# Altium project PCB_Project1.PrjPCB
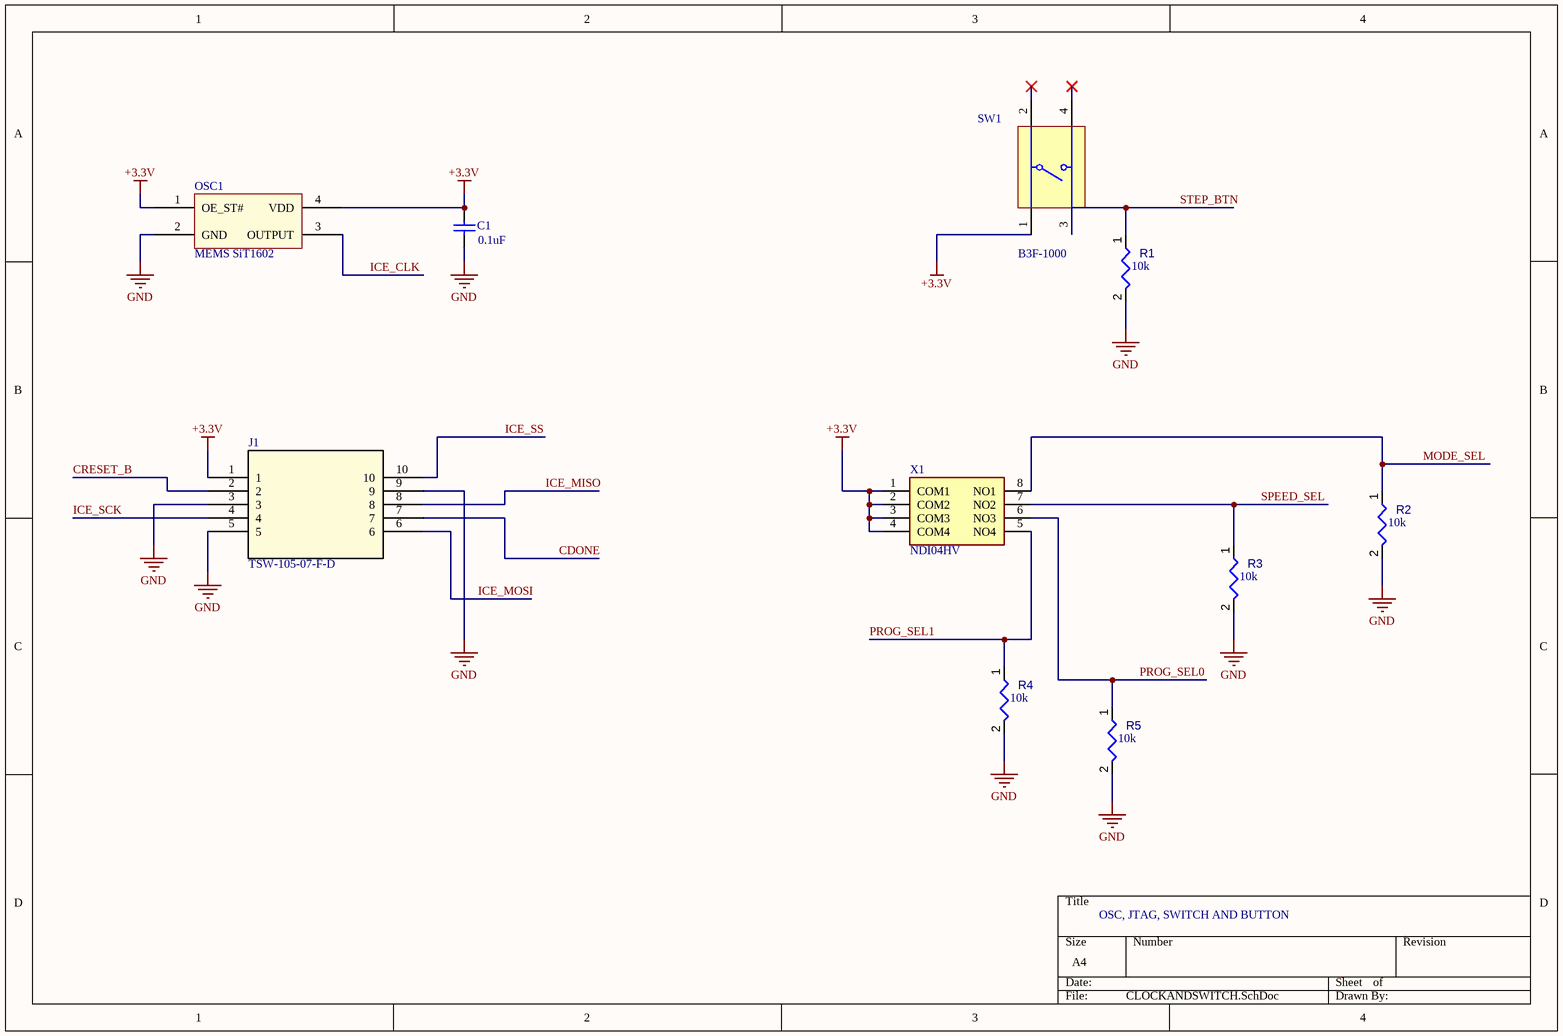
[diagram p0: CLOCKANDSWITCH.SchDoc]
4 sheets, 52 parts. Net scope: global (net labels, ports and power ports of the same name join across sheets).
Board file: PCB1.PcbDoc
Sheets:
  CLOCKANDSWITCH.SchDoc
  Misc.SchDoc
  FPGA.SchDoc
  7seg.SchDoc

## Sheet CLOCKANDSWITCH.SchDoc
size A4; PageSetup: Record=PageOptions|CenterHorizontal=True|CenterVertical=True|PrintScale=1.00|XCorrection=1.00|YCorrection=1.00|PrintKind=2|BorderSize=5000000|LeftOffset=0|BottomOffset=0|Orientation=2|PaperLength=1000|PaperWidth=1000|Scale=100|PaperSource=7|PrintQuality=-3|MediaType=1|DitherType=10|PrintScaleMode=1|PaperKind=A4|PaperIndex=9

### Parts
C1  value 0.1uF  [C0402]  (hidden comment: Cap Semi)
J1  TSW-105-07-F-D  [TSW-105-07-G-D_SAI]
OSC1  MEMS SiT1602  [oscMEMS1602]
R1  value 10k  [RESC2013X50X35ML15T15]  (hidden comment: Resistor 10k +/-1% 0805 125 mW)
R2  value 10k  [RESC2013X50X35ML15T15]  (hidden comment: Resistor 10k +/-1% 0805 125 mW)
R3  value 10k  [RESC2013X50X35ML15T15]  (hidden comment: Resistor 10k +/-1% 0805 125 mW)
R4  value 10k  [RESC2013X50X35ML15T15]  (hidden comment: Resistor 10k +/-1% 0805 125 mW)
R5  value 10k  [RESC2013X50X35ML15T15]  (hidden comment: Resistor 10k +/-1% 0805 125 mW)
SW1  B3F-1000  [OMRON-B3F-1000-4_V]
X1  NDI04HV  [NDI04HV]

### Nets
+3.3V: C1.2 J1.1 OSC1.1(OE_ST#) OSC1.4(VDD) SW1.1 X1.1(COM1) X1.2(COM2) X1.3(COM3) X1.4(COM4)
GND: C1.1 J1.3 J1.5 J1.9 OSC1.2(GND) R1.2 R2.2 R3.2 R4.2 R5.2
CDONE: J1.7
CRESET_B: J1.2
ICE_CLK: OSC1.3(OUTPUT)
ICE_MISO: J1.8
ICE_MOSI: J1.6
ICE_SCK: J1.4
ICE_SS: J1.10
MODE_SEL: R2.1 X1.8(NO1)
PROG_SEL0: R5.1 X1.6(NO3)
PROG_SEL1: R4.1 X1.5(NO4)
SPEED_SEL: R3.1 X1.7(NO2)
STEP_BTN: R1.1 SW1.3

Not connected (* = marked no-connect by the designer): SW1 2* 4*

### Notes on the sheet
- OSC, JTAG, SWITCH AND BUTTON

### Library data of the parts
C1 = Cap Semi: Capacitor (Semiconductor SIM Model); Manufacturer: Samsung Electro-Mechanics; Manufacturer Part Number: CL05B104KA5NNNC; Tolerance: ±10%; Voltage - Rated: 25V; Temperature Coefficient: X7R; Notification: Current market demand for these product types have resulted in fluctuating and extending lead times. Lead times may differ.; Published: 8-Jun-2000; LatestRevisionDate: 29-May-2009; LatestRevisionNote: IPC-7351 Footprint Added.; PackageReference: C1206; Publisher: Altium Limited; PackageDescription: Chip Capacitor; Supplier 1: Digi-Key; Supplier Part Number 1: 1276-6720-1-ND; RoHS: RoHS Compliant; Category: Capacitors; Stock 1: 0; Pricing 1: 1=0.1, 10=0.071, 100=0.0317, 500=0.02262, 1000=0.01777, 2500=0.01616, 5000=0.01486 (USD); Packaging: Cut Tape (CT); Part Status: Active; Operating Temperature: -55°C ~ 125°C; Features: -; Ratings: -; Applications: General Purpose; Mounting Type: Surface Mount, MLCC; Package / Case: 0402 (1005 Metric); Size / Dimension: 0.039" L x 0.020" W (1.00mm x 0.50mm); Height - Seated (Max): -; Thickness (Max): 0.022" (0.55mm); Lead Spacing: -; Lead Style: -; ComponentLink1URL: http://www.samsungsem.com/kr/support/product-search/mlcc/CL05B104KA5NNNC.jsp; ComponentLink1Description: http://www.samsungsem.com/kr/support/product-search/mlcc/CL05B104KA5NNNC.jsp
J1 = CMP-007-000000-1: Description; Manufacturer_Name: Samtec Inc; Source: TSW-105-07-F-D.SchLib; Design Item ID: TSW-105-07-F-D; Manufacturer_Part_Number: TSW-105-07-F-D; Copyright: Copyright (C) 2025 Ultra Librarian. All rights reserved.; Type: Type; RefDes: RefDes
OSC1 = SIT1602AC-13-33E-12.000000G: MEMS OSC XO 12.0000MHZ LVCMOS; Manufacturer: SiTIME; Function: Enable/Disable; Voltage - Supply: 3.3V; Frequency Stability: ±50ppm; Current - Supply (Max): 4.5mA; Current - Supply (Disable) (Max): 4mA; Supplier 1: Digi-Key; Manufacturer Part Number: SIT1602AC-13-33E-12.000000G; RoHS: RoHS Compliant; Category: Crystals, Oscillators, Resonators; Packaging: Cut Tape (CT); Part Status: Not For New Designs; Base Resonator: MEMS; Type: XO (Standard); Output: LVCMOS; Operating Temperature: -20°C ~ 70°C; Ratings: -; Mounting Type: Surface Mount; Package / Case: 4-SMD, No Lead; Size / Dimension: 0.098" L x 0.079" W (2.50mm x 2.00mm); Height - Seated (Max): 0.032" (0.80mm); ComponentLink1URL: https://media.digikey.com/pdf/Data%20Sheets/SiTime%20PDFs/SIT1602A.pdf; ComponentLink1Description: https://media.digikey.com/pdf/Data%20Sheets/SiTime%20PDFs/SIT1602A.pdf; Supplier Part Number 1: 1473-1051-1-ND; Pricing 1: 1=1.26, 10=1.118, 50=1.045, 100=0.9236 (USD)
R1-R5 = CMP-009-00018-5: Chip Resistor, 10 KOhm, +/- 1%, 125 mW, -55 to 155 degC, 0805 (2012 Metric); Power: 125mW; Voltage Rating: 150V; Tolerance: 1%; Pins: 2; Min Operating Temperature: -55°C; Case/Package: 0805; Max Operating Temperature: 155°C; RoHS Compliant: True; Mounting Technology: SM
SW1 = CMP-011-00004-2: Tactile Switch, SPST-NO, 0.05 A, 24 V, -25 to 70 degC, 4-Pin THD, RoHS, Bulk; Manufacturer: Omron Electronic Components; Throw Configuration: SPST; Max Contact Resistance: 100mohm; Resistance: 0.1Ohm; Max Current Rating: 50mA; Voltage Rating: 24V; Operating Force: 100gf; Datasheet Version: Jan-15; Case/Package: B3F-1000; Packaging: Bulk; Package Description: 4-Pin Through Hole Device, Body 6 x 6 mm; Manufacturer URL: http://www.omron.com/; Package Reference: B3F-1000; Contact Plating: Gold; Contact Current Rating: 50mA; RoHS Compliant: True; Contact Material: Gold; Mounting Technology: TH; Max Operating Temperature: 70°C; Min Operating Temperature: -25°C; Package Quantity: 1500; Datasheet URL: http://www.omron.com/ecb/products/pdf/en-b3f.pdf; Voltage Rating (DC): 24V; Pins: 4; Current Rating: 50mA; Max Voltage Rating (DC): 24V
X1 = CMP-014-000000-1: Dip Switch SPST 4 Position Through Hole Slide (Standard) Actuator 25mA 24VDC; Manufacturer_Name: Apem; Geometry.Height: 5mm; Mouser Part Number: 642-NDI04HV; Source: NDI04HV.SchLib; Mouser Price/Stock: https://www.mouser.co.uk/ProductDetail/Apem/NDI04HV/?qs=4pzlT8jjbheYf%2FxKjHex%252BQ%3D%3D; Datasheet Link: https://www.mouser.ca/datasheet/2/26/NDI_DM_DIPS-276092.pdf; Design Item ID: NDI04HV; Manufacturer_Part_Number: NDI04HV

## Sheet Misc.SchDoc
size A4
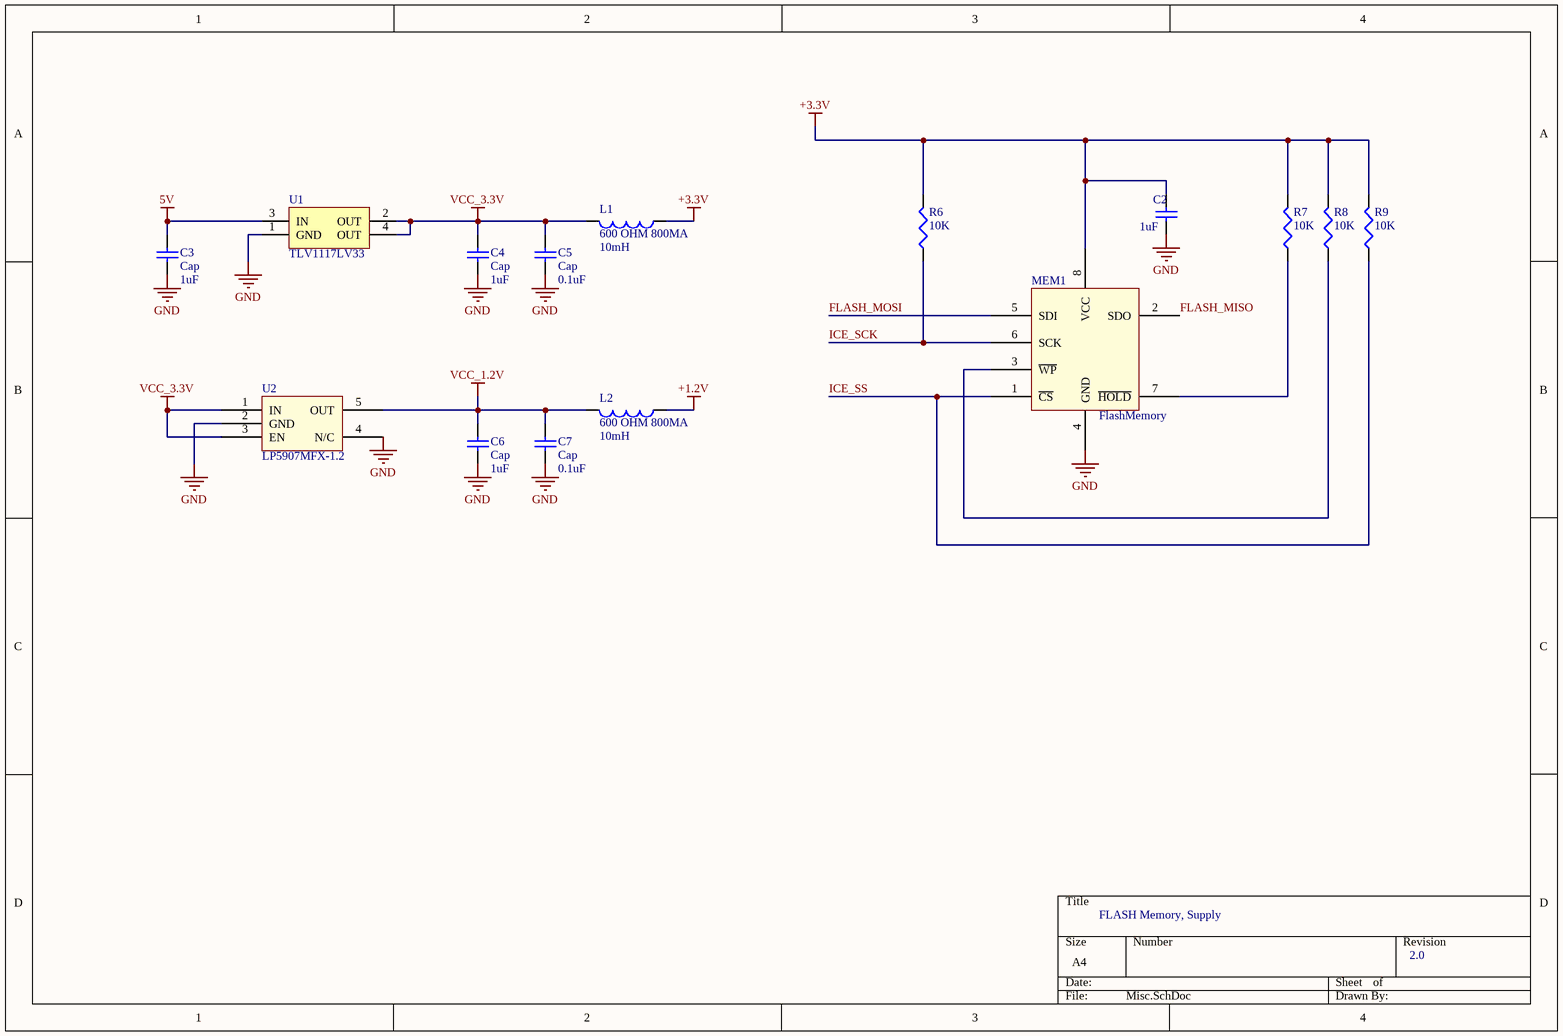
[diagram p1: Misc.SchDoc]

### Parts
C2  value 1uF  [C0402]  (hidden comment: Cap Semi)
C3  Cap  value 1uF  [C0603]
C4  Cap  value 1uF  [C0603]
C5  Cap  value 0.1uF  [C0402]
C6  Cap  value 1uF  [C0402]
C7  Cap  value 0.1uF  [C0402]
L1  600 OHM 800MA  value 10mH  [J1-0603]
L2  600 OHM 800MA  value 10mH  [J1-0603]
MEM1  FlashMemory  [SOP8FlashCorrect]
R6  value 10K  [R0402]  (hidden comment: Res3)
R7  value 10K  [R0402]  (hidden comment: Res3)
R8  value 10K  [R0402]  (hidden comment: Res3)
R9  value 10K  [R0402]  (hidden comment: Res3)
U1  TLV1117LV33  [ZZ311]
U2  LP5907MFX-1.2  [1-2Regulator]

### Nets
5V: C3.2 U1.3(IN)
+1.2V: L2.1
+3.3V: C2.2 L1.1 MEM1.8(VCC) R6.2 R7.2 R8.2 R9.2
GND: C2.1 C3.1 C4.1 C5.1 C6.1 C7.1 MEM1.4(GND) U1.1(GND) U2.2(GND) U2.4(N/C)
VCC_1.2V: C6.2 C7.2 L2.2 U2.5(OUT)
VCC_3.3V: C4.2 C5.2 L1.2 U1.2(OUT) U1.4(OUT) U2.1(IN) U2.3(EN)
FLASH_MISO: MEM1.2(SDO)
FLASH_MOSI: MEM1.5(SDI)
ICE_SCK: MEM1.6(SCK) R6.1
ICE_SS: MEM1.1(~{CS}) R9.1
NetMEM1_3: MEM1.3(~{WP}) R8.1
NetMEM1_7: MEM1.7(~{HOLD}) R7.1

### Notes on the sheet
- FLASH Memory, Supply
- 2.0

### Library data of the parts
C2 C6 = Cap Semi: Capacitor (Semiconductor SIM Model); Manufacturer: TDK Corporation; Manufacturer Part Number: CGB2A1JB1E105M033BC; Tolerance: ±20%; Voltage - Rated: 25V; Temperature Coefficient: JB; Notification: Current market demand for these product types have resulted in fluctuating and extending lead times. Lead times may differ.; Published: 8-Jun-2000; LatestRevisionDate: 29-May-2009; LatestRevisionNote: IPC-7351 Footprint Added.; PackageReference: C1206; Publisher: Altium Limited; PackageDescription: Chip Capacitor; Supplier 1: Digi-Key; Supplier Part Number 1: 445-12016-1-ND; RoHS: RoHS Compliant; Category: Capacitors; Stock 1: 0; Pricing 1: 1=0.25, 10=0.173, 100=0.0874, 500=0.0598, 1000=0.0529, 2500=0.0506, 5000=0.046 (USD); Packaging: Cut Tape (CT); Part Status: Active; Operating Temperature: -25°C ~ 85°C; Features: Low Profile; Ratings: -; Applications: General Purpose; Failure Rate: -; Mounting Type: Surface Mount, MLCC; Package / Case: 0402 (1005 Metric); Size / Dimension: 0.039" L x 0.020" W (1.00mm x 0.50mm); Height - Seated (Max): -; Thickness (Max): 0.013" (0.33mm); Lead Spacing: -; Lead Style: -; ComponentLink1URL: https://product.tdk.com/info/en/catalog/datasheets/mlcc_commercial_lowprofile_en.pdf; ComponentLink1Description: https://product.tdk.com/info/en/catalog/datasheets/mlcc_commercial_lowprofile_en.pdf
C3 C4 = Cap Semi: Capacitor (Semiconductor SIM Model); Manufacturer: Yageo; Manufacturer Part Number: CC0603KRX5R8BB105; Tolerance: ±10%; Voltage - Rated: 25V; Temperature Coefficient: X5R; Notification: Current market demand for these product types have resulted in fluctuating and extending lead times. Lead times may differ.; Published: 8-Jun-2000; LatestRevisionDate: 29-May-2009; LatestRevisionNote: IPC-7351 Footprint Added.; PackageReference: C1206; Publisher: Altium Limited; PackageDescription: Chip Capacitor; Supplier 1: Digi-Key; Supplier Part Number 1: 311-1445-1-ND; RoHS: RoHS Compliant; Category: Capacitors; Stock 1: 40000; Pricing 1: 1=0.25, 10=0.179, 100=0.0843, 500=0.05908, 1000=0.04891 (USD); Packaging: Cut Tape (CT); Part Status: Active; Operating Temperature: -55°C ~ 85°C; Features: -; Ratings: -; Applications: General Purpose; Failure Rate: -; Mounting Type: Surface Mount, MLCC; Package / Case: 0603 (1608 Metric); Size / Dimension: 0.063" L x 0.031" W (1.60mm x 0.80mm); Height - Seated (Max): -; Thickness (Max): 0.035" (0.90mm); Lead Spacing: -; Lead Style: -; ComponentLink1URL: http://www.yageo.com/documents/recent/UPY-GPHC_X5R_4V-to-50V_25.pdf; ComponentLink1Description: http://www.yageo.com/documents/recent/UPY-GPHC_X5R_4V-to-50V_25.pdf
C5 C7 = Cap Semi: as C1 on sheet CLOCKANDSWITCH; Published: 8-Jun-2000; LatestRevisionDate: 29-May-2009; LatestRevisionNote: IPC-7351 Footprint Added.; PackageReference: C1206; Publisher: Altium Limited; PackageDescription: Chip Capacitor; Supplier 1: Digi-Key; Supplier Part Number 1: 1276-6720-1-ND; RoHS: RoHS Compliant; Category: Capacitors; Stock 1: 0; Pricing 1: 1=0.1, 10=0.071, 100=0.0317, 500=0.02262, 1000=0.01777, 2500=0.01616, 5000=0.01486 (USD); Packaging: Cut Tape (CT); Part Status: Active; Operating Temperature: -55°C ~ 125°C; Features: -; Ratings: -; Applications: General Purpose; Mounting Type: Surface Mount, MLCC; Package / Case: 0402 (1005 Metric); Size / Dimension: 0.039" L x 0.020" W (1.00mm x 0.50mm); Height - Seated (Max): -; Thickness (Max): 0.022" (0.55mm); Lead Spacing: -; Lead Style: -; ComponentLink1URL: http://www.samsungsem.com/kr/support/product-search/mlcc/CL05B104KA5NNNC.jsp; ComponentLink1Description: http://www.samsungsem.com/kr/support/product-search/mlcc/CL05B104KA5NNNC.jsp
L1 L2 = Inductor: Manufacturer: Murata Electronics North America; Manufacturer Part Number: BLM18HE601SN1D; Code_IEC: 1005; Filter Type: Signal Line; DC Resistance (DCR) (Max): 250 mOhm; Published: 8-Jun-2000; LatestRevisionDate: 29-May-2009; LatestRevisionNote: IPC-7351 Footprint Added.; PackageReference: 0402-A; Publisher: Altium Limited; PackageDescription: Chip Inductor; Code_JEITA: 0402; Supplier 1: Digi-Key; Supplier Part Number 1: 490-5214-1-ND; RoHS: RoHS Compliant; Category: Filters; Stock 1: 152784; Pricing 1: 1=0.22, 10=0.179, 25=0.1392, 50=0.1154, 100=0.0996, 250=0.07964, 500=0.07168, 1000=0.05973 (USD); Packaging: Cut Tape (CT); Part Status: Active; Current Rating (Max): 800mA; Ratings: -; Operating Temperature: -55°C ~ 125°C; Package / Case: 0603 (1608 Metric); Mounting Type: Surface Mount; Height (Max): 0.037" (0.95mm); Size / Dimension: 0.063" L x 0.032" W (1.60mm x 0.80mm); ComponentLink1URL: https://www.murata.com/en-us/products/productdata/8796741599262/ENFA0004.pdf; ComponentLink1Description: https://www.murata.com/en-us/products/productdata/8796741599262/ENFA0004.pdf
MEM1 = W25Q32JVSSIQ: IC FLASH 32M SPI 133MHZ 8SOIC; Manufacturer: Winbond Electronics; Memory Type: Non-Volatile; Write Cycle Time - Word, Page: 3ms; Voltage - Supply: 2.7 V ~ 3.6 V; Memory Interface: SPI - Quad I/O; Memory Size: 32Mb (4M x 8); Memory Format: FLASH; RoHS: RoHS Compliant; Manufacturer Part Number: W25Q32JVSSIQ; Technology: FLASH - NOR; Part Status: Active; Packaging: Tube; Category: Integrated Circuits (ICs); Supplier Device Package: 8-SOIC; Mounting Type: Surface Mount; Operating Temperature: -40°C ~ 85°C (TA); Package / Case: 8-SOIC (0.209", 5.30mm Width); ComponentLink1URL: http://www.winbond.com/resource-files/w25q32jv%20revg%2003272018%20plus.pdf; ComponentLink1Description: http://www.winbond.com/resource-files/w25q32jv%20revg%2003272018%20plus.pdf; Supplier 1: Digi-Key; Stock 1: 41181; Pricing 1: 1=0.81, 10=0.74, 25=0.7308, 90=0.72667, 180=0.64972, 270=0.64411, 540=0.63474, 810=0.62498, 1080=0.61183 (USD); Supplier Part Number 1: W25Q32JVSSIQ-ND
R6-R9 = Res3: Resistor; Manufacturer: Yageo; Manufacturer Part Number: RC0402JR-0710KP; Tolerance: ±5%; Power (Watts): 0.063W, 1/16W; Temperature Coefficient: ±150ppm/°C; Published: 8-Jun-2000; LatestRevisionDate: 29-May-2009; LatestRevisionNote: IPC-7351 Footprint Added.; PackageReference: J1-0603; Publisher: Altium Limited; PackageDescription: Chip Resistor; Supplier 1: Digi-Key; Supplier Part Number 1: YAG1281CT-ND; RoHS: RoHS Compliant; Category: Resistors; Stock 1: 0; Pricing 1: 1=0.1, 10=0.028, 100=0.0119, 1000=0.00557, 2500=0.0049, 5000=0.00411 (USD); Packaging: Cut Tape (CT); Part Status: Active; Composition: Thick Film; Features: Moisture Resistant; Operating Temperature: -55°C ~ 155°C; Package / Case: 0402 (1005 Metric); Supplier Device Package: 0402; Size / Dimension: 0.039" L x 0.020" W (1.00mm x 0.50mm); Height - Seated (Max): 0.016" (0.40mm); Failure Rate: -; ComponentLink1URL: http://www.yageo.com/NewPortal/yageodocoutput?fileName=/pdf/R-Chip/PYu-RC_51_RoHS_P_0.pdf; ComponentLink1Description: http://www.yageo.com/NewPortal/yageodocoutput?fileName=/pdf/R-Chip/PYu-RC_51_RoHS_P_0.pdf
U1 = TLV1117LV33DCYR: IC REG LINEAR 3.3V 1A SOT223-4; Manufacturer: Texas Instruments; Output Configuration: Positive; Output Type: Fixed; Voltage - Input (Max): 5.5V; Voltage Dropout (Max): 1.3V @ 800mA; PSRR: 75dB (120Hz); Protection Features: Over Current, Over Temperature; ComponentLink1Description: http://www.ti.com/lit/ds/symlink/tlv1117lv.pdf; ComponentLink1URL: http://www.ti.com/lit/ds/symlink/tlv1117lv.pdf; Supplier 1: Digi-Key; Manufacturer Part Number: TLV1117LV33DCYR; RoHS: RoHS Compliant; Category: Integrated Circuits (ICs); Stock 1: 20855; Packaging: Cut Tape (CT); Part Status: Active; Voltage - Output (Min/Fixed): 3.3V; Voltage - Output (Max): -; Current - Output: 1A; Control Features: -; Operating Temperature: -40°C ~ 125°C; Mounting Type: Surface Mount; Package / Case: TO-261-4, TO-261AA; Supplier Device Package: SOT-223-4; Base Part Number: TLV1117LV33; Supplier Part Number 1: 296-28778-1-ND; Pricing 1: 1=0.68, 10=0.598, 100=0.4586, 500=0.36256, 1000=0.29005 (USD)
U2 = LP5907MFX-1.2/NOPB: IC REG LINEAR 1.2V 250MA SOT23-5; Manufacturer: Texas Instruments; Output Configuration: Positive; Output Type: Fixed; Voltage - Input (Max): 5.5V; Voltage Dropout (Max): 0.25V @ 250mA; PSRR: 90dB ~ 60dB (100Hz ~ 100kHz); Control Features: Enable; Protection Features: Over Temperature, Short Circuit; Supplier 1: Digi-Key; Manufacturer Part Number: LP5907MFX-1.2/NOPB; RoHS: RoHS Compliant; Category: Integrated Circuits (ICs); Stock 1: 65117; Packaging: Cut Tape (CT); Part Status: Active; Voltage - Output (Min/Fixed): 1.2V; Voltage - Output (Max): -; Current - Output: 250mA; Operating Temperature: -40°C ~ 125°C; Mounting Type: Surface Mount; Package / Case: SC-74A, SOT-753; Supplier Device Package: SOT-23-5; ComponentLink1URL: http://www.ti.com/lit/ds/symlink/lp5907.pdf; ComponentLink1Description: http://www.ti.com/lit/ds/symlink/lp5907.pdf; Supplier Part Number 1: 296-39062-1-ND; Pricing 1: 1=0.55, 10=0.475, 100=0.3547, 500=0.27872, 1000=0.21537 (USD)

## Sheet FPGA.SchDoc
size A4
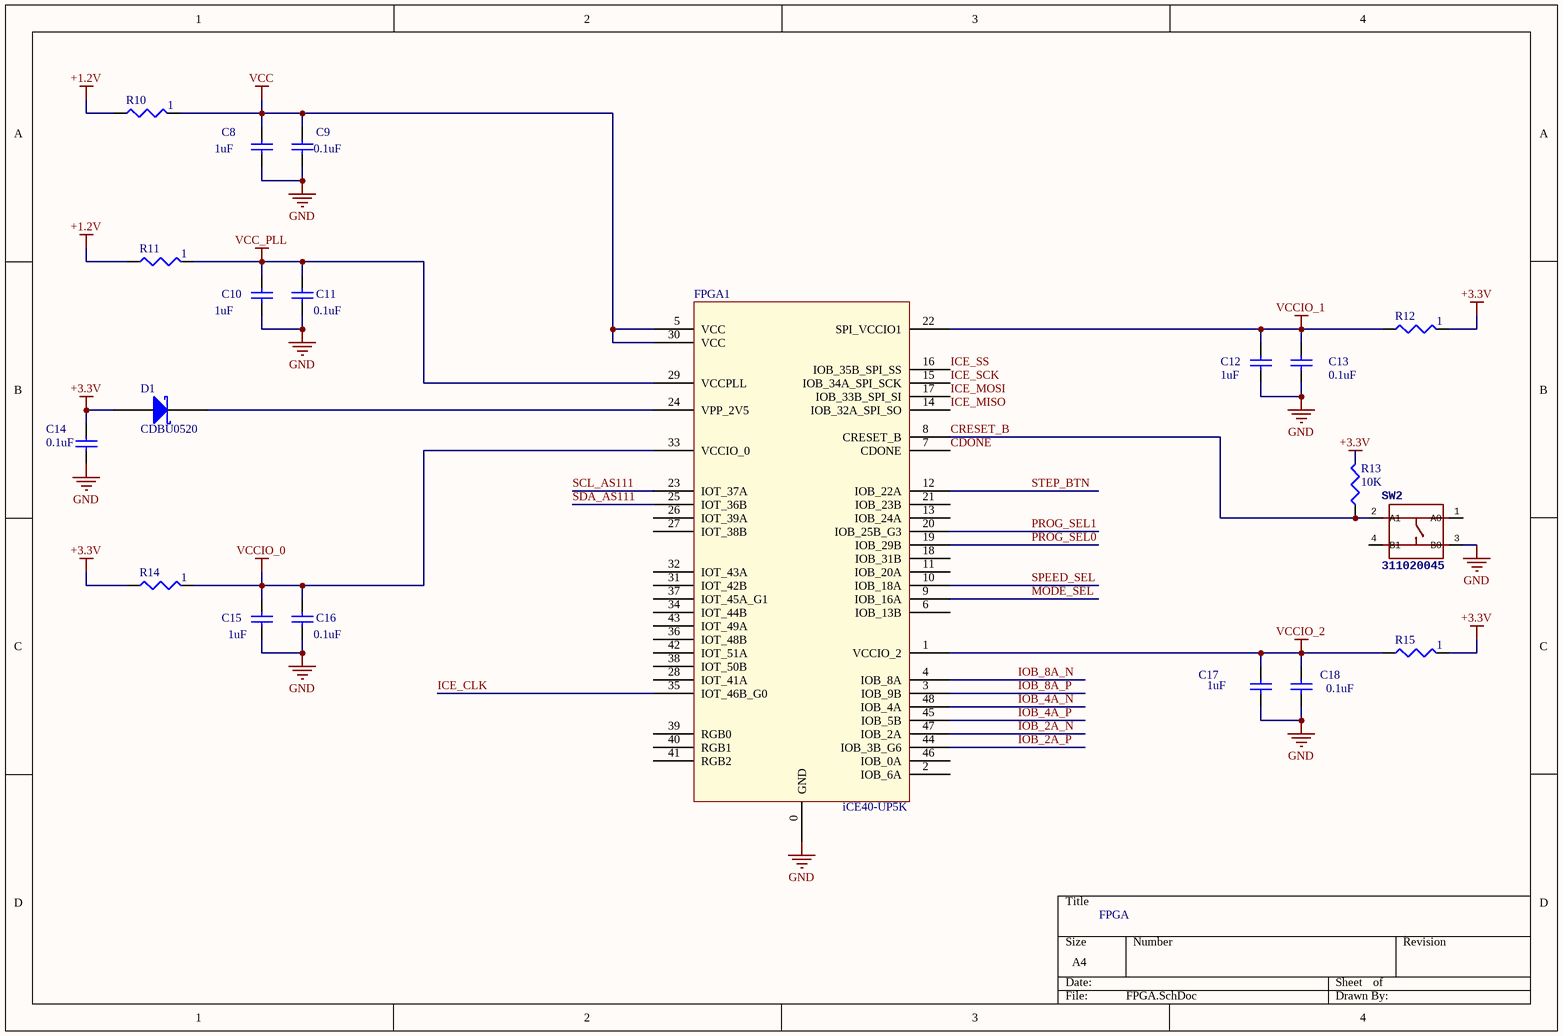
[diagram p2: FPGA.SchDoc]

### Parts
C8  value 1uF  [C0402]  (hidden comment: Cap Semi)
C9  value 0.1uF  [C0402]  (hidden comment: Cap Semi)
C10  value 1uF  [C0402]  (hidden comment: Cap Semi)
C11  value 0.1uF  [C0402]  (hidden comment: Cap Semi)
C12  value 1uF  [C0402]  (hidden comment: Cap Semi)
C13  value 0.1uF  [C0402]  (hidden comment: Cap Semi)
C14  value 0.1uF  [C0402]  (hidden comment: Cap Semi)
C15  value 1uF  [C0402]  (hidden comment: Cap Semi)
C16  value 0.1uF  [C0402]  (hidden comment: Cap Semi)
C17  value 1uF  [C0402]  (hidden comment: Cap Semi)
C18  value 0.1uF  [C0402]  (hidden comment: Cap Semi)
D1  CDBU0520  [CDBU0520]
FPGA1  iCE40-UP5K  [SLAB-QFN48-7X7-MD]
R10  value 1  [R0402]  (hidden comment: Res3)
R11  value 1  [R0402]  (hidden comment: Res3)
R12  value 1  [R0402]  (hidden comment: Res3)
R13  value 10K  [R0402]  (hidden comment: Res3)
R14  value 1  [R0402]  (hidden comment: Res3)
R15  value 1  [R0402]  (hidden comment: Res3)
SW2  311020045  [SW4-SMD-4.2X3.2X2.5MM]

### Nets
+1.2V: R10.1 R11.1
+3.3V: C14.2 D1.1 R12.2 R13.2 R14.1 R15.2
GND: C8.1 C9.1 C10.1 C11.1 C12.1 C13.1 C14.1 C15.1 C16.1 C17.1 C18.1 FPGA1.0(GND) SW2.3(B0)
VCC: C8.2 C9.2 FPGA1.5(VCC) FPGA1.30(VCC) R10.2
VCC_PLL: C10.2 C11.2 FPGA1.29(VCCPLL) R11.2
VCCIO_0: C15.2 C16.2 FPGA1.33(VCCIO_0) R14.2
VCCIO_1: C12.2 C13.2 FPGA1.22(SPI_VCCIO1) R12.1
VCCIO_2: C17.2 C18.2 FPGA1.1(VCCIO_2) R15.1
CDONE: FPGA1.7(CDONE)
CRESET_B: FPGA1.8(CRESET_B) R13.1 SW2.2(A1)
ICE_CLK: FPGA1.35(IOT_46B_G0)
ICE_MISO: FPGA1.14(IOB_32A_SPI_SO)
ICE_MOSI: FPGA1.17(IOB_33B_SPI_SI)
ICE_SCK: FPGA1.15(IOB_34A_SPI_SCK)
ICE_SS: FPGA1.16(IOB_35B_SPI_SS)
IOB_2A_N: FPGA1.47(IOB_2A)
IOB_2A_P: FPGA1.44(IOB_3B_G6)
IOB_4A_N: FPGA1.48(IOB_4A)
IOB_4A_P: FPGA1.45(IOB_5B)
IOB_8A_N: FPGA1.4(IOB_8A)
IOB_8A_P: FPGA1.3(IOB_9B)
MODE_SEL: FPGA1.9(IOB_16A)
PROG_SEL0: FPGA1.19(IOB_29B)
PROG_SEL1: FPGA1.20(IOB_25B_G3)
SCL_AS111: FPGA1.23(IOT_37A)
SDA_AS111: FPGA1.25(IOT_36B)
SPEED_SEL: FPGA1.10(IOB_18A)
STEP_BTN: FPGA1.12(IOB_22A)
NetD1_2: D1.2 FPGA1.24(VPP_2V5)

Not connected (* = marked no-connect by the designer): FPGA1 2(IOB_6A) 6(IOB_13B) 11(IOB_20A) 13(IOB_24A) 18(IOB_31B) 21(IOB_23B) 26(IOT_39A) 27(IOT_38B) 28(IOT_41A) 31(IOT_42B) 32(IOT_43A) 34(IOT_44B) 36(IOT_48B) 37(IOT_45A_G1) 38(IOT_50B) 39(RGB0) 40(RGB1) 41(RGB2) 42(IOT_51A) 43(IOT_49A) 46(IOB_0A); SW2 1(A0) 4(B1)

### Notes on the sheet
- FPGA

### Library data of the parts
C8 C10 C12 C15 C17 = Cap Semi: as C2 on sheet Misc; Published: 8-Jun-2000; LatestRevisionDate: 29-May-2009; LatestRevisionNote: IPC-7351 Footprint Added.; PackageReference: C1206; Publisher: Altium Limited; PackageDescription: Chip Capacitor; Supplier 1: Digi-Key; Supplier Part Number 1: 445-12016-1-ND; RoHS: RoHS Compliant; Category: Capacitors; Stock 1: 0; Pricing 1: 1=0.25, 10=0.173, 100=0.0874, 500=0.0598, 1000=0.0529, 2500=0.0506, 5000=0.046 (USD); Packaging: Cut Tape (CT); Part Status: Active; Operating Temperature: -25°C ~ 85°C; Features: Low Profile; Ratings: -; Applications: General Purpose; Failure Rate: -; Mounting Type: Surface Mount, MLCC; Package / Case: 0402 (1005 Metric); Size / Dimension: 0.039" L x 0.020" W (1.00mm x 0.50mm); Height - Seated (Max): -; Thickness (Max): 0.013" (0.33mm); Lead Spacing: -; Lead Style: -; ComponentLink1URL: https://product.tdk.com/info/en/catalog/datasheets/mlcc_commercial_lowprofile_en.pdf; ComponentLink1Description: https://product.tdk.com/info/en/catalog/datasheets/mlcc_commercial_lowprofile_en.pdf
C9 C11 C13 C14 C16 C18 = Cap Semi: as C1 on sheet CLOCKANDSWITCH; Published: 8-Jun-2000; LatestRevisionDate: 29-May-2009; LatestRevisionNote: IPC-7351 Footprint Added.; PackageReference: C1206; Publisher: Altium Limited; PackageDescription: Chip Capacitor; Supplier 1: Digi-Key; Supplier Part Number 1: 1276-6720-1-ND; RoHS: RoHS Compliant; Category: Capacitors; Stock 1: 0; Pricing 1: 1=0.1, 10=0.071, 100=0.0317, 500=0.02262, 1000=0.01777, 2500=0.01616, 5000=0.01486 (USD); Packaging: Cut Tape (CT); Part Status: Active; Operating Temperature: -55°C ~ 125°C; Features: -; Ratings: -; Applications: General Purpose; Mounting Type: Surface Mount, MLCC; Package / Case: 0402 (1005 Metric); Size / Dimension: 0.039" L x 0.020" W (1.00mm x 0.50mm); Height - Seated (Max): -; Thickness (Max): 0.022" (0.55mm); Lead Spacing: -; Lead Style: -; ComponentLink1URL: http://www.samsungsem.com/kr/support/product-search/mlcc/CL05B104KA5NNNC.jsp; ComponentLink1Description: http://www.samsungsem.com/kr/support/product-search/mlcc/CL05B104KA5NNNC.jsp
D1 = CDBU0520: DIODE SCHOTTKY 20V 500MA 0603; pin to pad: 1>+ 2>-; Manufacturer: Comchip Technology; Speed: Fast Recovery =< 500ns, > 200mA (Io); Capacitance @ Vr, F: 100pF @ 0V, 1MHz; Packaging: Cut Tape (CT); Base Part Number: CDBU0520; Operating Temperature - Junction: 125°C (Max); Category: Discrete Semiconductor Products; Diode Type: Schottky; Supplier Device Package: 0603/SOD-523F; Package / Case: 2-SMD, No Lead; Mounting Type: Surface Mount; Manufacturer Part Number: CDBU0520; RoHS: RoHS Compliant; Part Status: Active; Current - Average Rectified (Io): 500mA; ComponentLink1URL: http://www.comchiptech.com/admin/files/product/CDBU0520-HF-RevA797161.pdf; ComponentLink1Description: http://www.comchiptech.com/admin/files/product/CDBU0520-HF-RevA797161.pdf; Supplier 1: Digi-Key; Stock 1: 262344; Pricing 1: 1=0.47, 10=0.333, 100=0.2186, 500=0.12916, 1000=0.09935 (USD); Supplier Part Number 1: 641-1332-1-ND
FPGA1 = iCE40-UP5K FPGA: Manufacturer: Lattice Semiconductor Corporation; Manufacturer Part Number: ICE40UP5K-SG48ITR50; Voltage - Supply: 1.14 V ~ 1.26 V; Mounting Type: Surface Mount; Category: Integrated Circuits (ICs); Package / Case: 48-VFQFN Exposed Pad; Operating Temperature: -40°C ~ 100°C (TJ); Part Status: Discontinued at Digi-Key; RoHS: RoHS Compliant; Supplier Device Package: 48-QFN (7x7); ComponentLink1URL: http://www.latticesemi.com/view_document?document_id=51968; ComponentLink1Description: http://www.latticesemi.com/view_document?document_id=51968; Stock 1: 514; Supplier 1: Digi-Key; Pricing 1: 1=6.06 (USD); Supplier Part Number 1: 220-2145-1-ND
R10-R12 R14 R15 = Res3: Resistor; Manufacturer: Yageo; Manufacturer Part Number: AC0402JR-071RL; Tolerance: ±5%; Power (Watts): 0.063W, 1/16W; Temperature Coefficient: ±200ppm/°C; Published: 8-Jun-2000; LatestRevisionDate: 29-May-2009; LatestRevisionNote: IPC-7351 Footprint Added.; PackageReference: J1-0603; Publisher: Altium Limited; PackageDescription: Chip Resistor; Supplier 1: Digi-Key; Supplier Part Number 1: YAG3527CT-ND; RoHS: RoHS Compliant; Category: Resistors; Stock 1: 19312; Pricing 1: 1=0.1, 10=0.026, 100=0.0104, 1000=0.00469, 2500=0.00407, 5000=0.00336 (USD); Packaging: Cut Tape (CT); Part Status: Active; Composition: Thick Film; Features: Automotive AEC-Q200, Moisture Resistant; Operating Temperature: -55°C ~ 155°C; Package / Case: 0402 (1005 Metric); Supplier Device Package: 0402; Size / Dimension: 0.039" L x 0.020" W (1.00mm x 0.50mm); Height - Seated (Max): 0.015" (0.37mm); Failure Rate: -; ComponentLink1URL: http://www.yageo.com/NewPortal/yageodocoutput?fileName=/pdf/R-Chip/PYu-AC_51_RoHS_L_6.pdf; ComponentLink1Description: http://www.yageo.com/NewPortal/yageodocoutput?fileName=/pdf/R-Chip/PYu-AC_51_RoHS_L_6.pdf
R13 = Res3: as R6 on sheet Misc; Published: 8-Jun-2000; LatestRevisionDate: 29-May-2009; LatestRevisionNote: IPC-7351 Footprint Added.; PackageReference: J1-0603; Publisher: Altium Limited; PackageDescription: Chip Resistor; Supplier 1: Digi-Key; Supplier Part Number 1: YAG1281CT-ND; RoHS: RoHS Compliant; Category: Resistors; Stock 1: 0; Pricing 1: 1=0.1, 10=0.028, 100=0.0119, 1000=0.00557, 2500=0.0049, 5000=0.00411 (USD); Packaging: Cut Tape (CT); Part Status: Active; Composition: Thick Film; Features: Moisture Resistant; Operating Temperature: -55°C ~ 155°C; Package / Case: 0402 (1005 Metric); Supplier Device Package: 0402; Size / Dimension: 0.039" L x 0.020" W (1.00mm x 0.50mm); Height - Seated (Max): 0.016" (0.40mm); Failure Rate: -; ComponentLink1URL: http://www.yageo.com/NewPortal/yageodocoutput?fileName=/pdf/R-Chip/PYu-RC_51_RoHS_P_0.pdf; ComponentLink1Description: http://www.yageo.com/NewPortal/yageodocoutput?fileName=/pdf/R-Chip/PYu-RC_51_RoHS_P_0.pdf
SW2 = PTS810 SJM 250 SMTR LFS: SWITCH TACTILE SPST-NO 0.05A 16V; MPN: DHT-4235A; Manufacturer: C&K; Manufacturer Part Number: KXT 331 LHS; Switch Function: Off-Mom; Contact Rating @ Voltage: 0.02A @ 15VDC; Actuator Type: Standard; Actuator Height off PCB, Vertical: 0.60mm; Actuator Orientation: Top Actuated; Outline: 3.00mm x 2.00mm; Illumination: Non-Illuminated; Operating Force: 240gf; Switch Travel: 0.13mm; Mechanical Life: 500,000 Cycles; Supplier 1: Digi-Key; RoHS: RoHS Compliant; Category: Switches; Stock 1: 220949; Packaging: Cut Tape (CT); Part Status: Active; Circuit: SPST-NO; Mounting Type: Surface Mount; Actuator Length, Right Angle: -; Termination Style: SMD (SMT) Tab; Illumination Type, Color: -; Illumination Voltage (Nominal): -; Ingress Protection: -; Features: -; Operating Temperature: -40°C ~ 85°C; Actuator Material: -; ComponentLink1URL: https://www.ckswitches.com/media/1465/kxt3.pdf; ComponentLink1Description: https://www.ckswitches.com/media/1465/kxt3.pdf; Supplier Part Number 1: CKN10502CT-ND; Pricing 1: 1=0.3, 10=0.287, 25=0.2768, 50=0.267, 100=0.2521, 250=0.23728, 500=0.2274, 1000=0.17302 (USD); ComponentLink2URL: https://www.ckswitches.com/media/1476/pts810.pdf; ComponentLink2Description: https://www.ckswitches.com/media/1476/pts810.pdf

## Sheet 7seg.SchDoc
size A
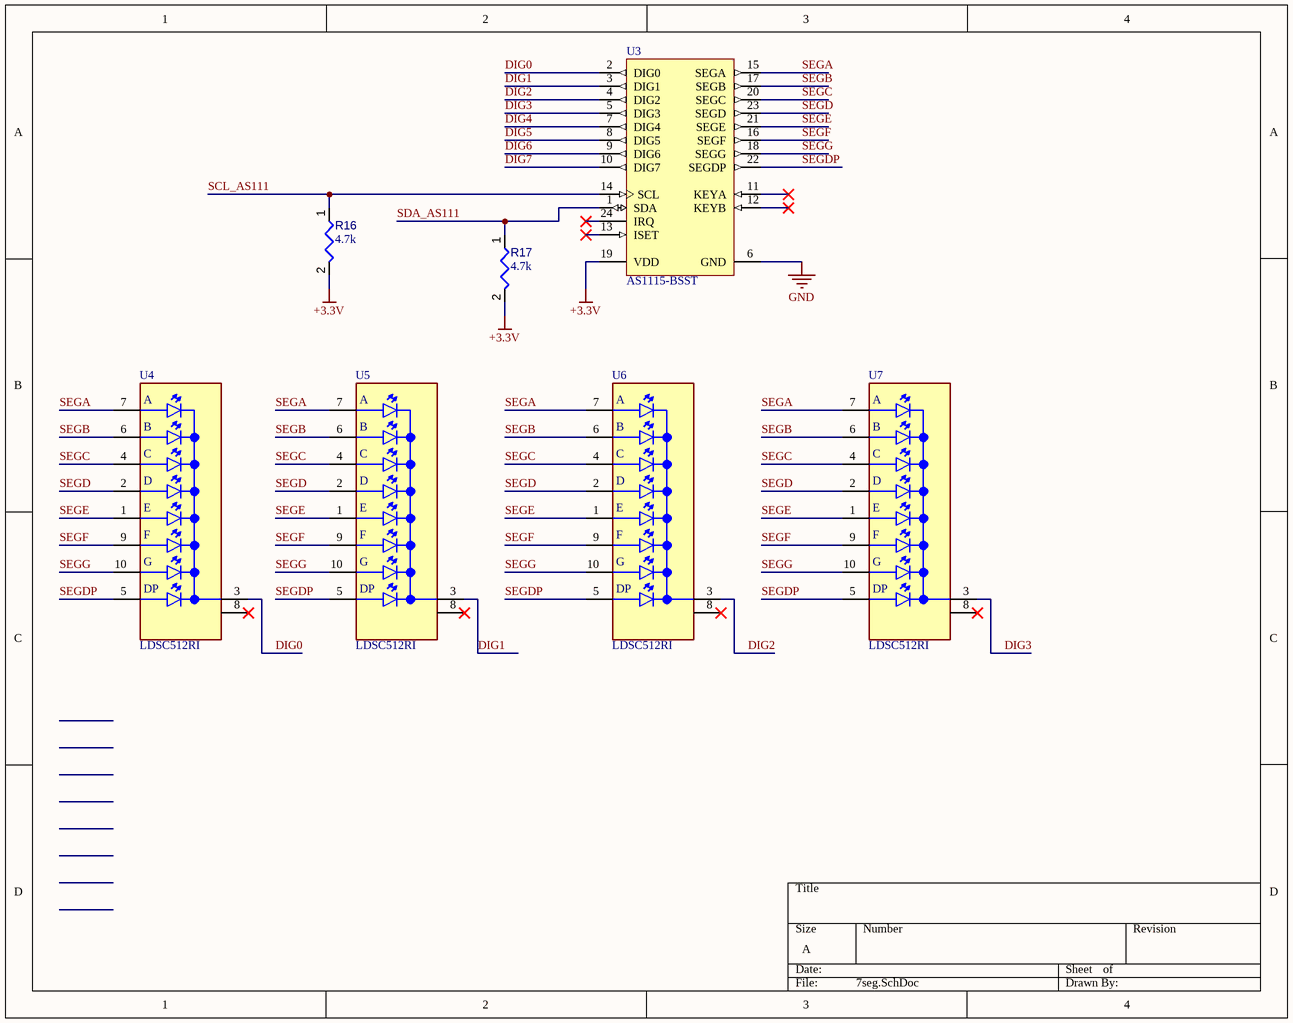
[diagram p3: 7seg.SchDoc]

### Parts
R16  value 4.7k  [RESC0402(1005)_L]  (hidden comment: Resistor 4K7  +/-1 % 0402 63 mW)
R17  value 4.7k  [RESC0402(1005)_L]  (hidden comment: Resistor 4K7  +/-1 % 0402 63 mW)
U3  AS1115-BSST  [AMS-QSOP-24-8645X3900DE_N]
U4  LDSC512RI  [LED_LDSC512RI]
U5  LDSC512RI  [LED_LDSC512RI]
U6  LDSC512RI  [LED_LDSC512RI]
U7  LDSC512RI  [LED_LDSC512RI]

### Nets
+3.3V: R16.2 R17.2 U3.19(VDD)
GND: U3.6(GND)
DIG0: U3.2(DIG0) U4.3(CC)
DIG1: U3.3(DIG1) U5.3(CC)
DIG2: U3.4(DIG2) U6.3(CC)
DIG3: U3.5(DIG3) U7.3(CC)
DIG4: U3.7(DIG4)
DIG5: U3.8(DIG5)
DIG6: U3.9(DIG6)
DIG7: U3.10(DIG7)
SCL_AS111: R16.1 U3.14(SCL)
SDA_AS111: R17.1 U3.1(SDA)
SEGA: U3.15(SEGA) U4.7(A) U5.7(A) U6.7(A) U7.7(A)
SEGB: U3.17(SEGB) U4.6(B) U5.6(B) U6.6(B) U7.6(B)
SEGC: U3.20(SEGC) U4.4(C) U5.4(C) U6.4(C) U7.4(C)
SEGD: U3.23(SEGD) U4.2(D) U5.2(D) U6.2(D) U7.2(D)
SEGDP: U3.22(SEGDP) U4.5(DP) U5.5(DP) U6.5(DP) U7.5(DP)
SEGE: U3.21(SEGE) U4.1(E) U5.1(E) U6.1(E) U7.1(E)
SEGF: U3.16(SEGF) U4.9(F) U5.9(F) U6.9(F) U7.9(F)
SEGG: U3.18(SEGG) U4.10(G) U5.10(G) U6.10(G) U7.10(G)

Not connected (* = marked no-connect by the designer): U3 11(KEYA)* 12(KEYB)* 13(ISET)* 24(IRQ)*; U4 8(CC)*; U5 8(CC)*; U6 8(CC)*; U7 8(CC)*

### Library data of the parts
R16 R17 = CMP-009-00158-3: Chip Resistor, 4,7 kOhms, +/-1 %, 63 mW, -55 to 155 degC, 0402; Power: 63mW; Tolerance: 1%; Max Operating Temperature: 155°C; Pins: 2; Min Operating Temperature: -55°C; Case/Package: 0402
U3 = CMP-001-0000-1: 8Digits Tape & Reel (TR) 8x (7Segment) 64LED SERIAL display driver 350muA 5.5V 8.66mm -40C~85C
U4-U7 = CMP-009-000000-1: .56IN. 7 SEGMENT SINGLE DISPLAY, 565NM GREEN, GRAY FACE, WHITE SEGMENTS, COMMON; MF: Lumex; MP: LDS-C512RI; Component Type: Standard; Package: None; Value: *; Pin Count: 10; Design Item ID: LDSC512RI; Check_prices: https://www.snapeda.com/parts/LDS-C512RI/Lumex/view-part/?ref=eda; Source: LDSC512RI.SchLib; SnapEDA_Link: https://www.snapeda.com/parts/LDS-C512RI/Lumex/view-part/?ref=snap

## Nets that join several sheets
+1.2V: Misc (L2.1), FPGA (R10.1 R11.1)
+3.3V: CLOCKANDSWITCH (9 pins), Misc (7 pins), FPGA (6 pins), 7seg (R16.2 R17.2 U3.19)
GND: CLOCKANDSWITCH (10 pins), Misc (10 pins), FPGA (13 pins), 7seg (U3.6)
CDONE: CLOCKANDSWITCH (J1.7), FPGA (FPGA1.7)
CRESET_B: CLOCKANDSWITCH (J1.2), FPGA (FPGA1.8 R13.1 SW2.2)
ICE_CLK: CLOCKANDSWITCH (OSC1.3), FPGA (FPGA1.35)
ICE_MISO: CLOCKANDSWITCH (J1.8), FPGA (FPGA1.14)
ICE_MOSI: CLOCKANDSWITCH (J1.6), FPGA (FPGA1.17)
ICE_SCK: CLOCKANDSWITCH (J1.4), Misc (MEM1.6 R6.1), FPGA (FPGA1.15)
ICE_SS: CLOCKANDSWITCH (J1.10), Misc (MEM1.1 R9.1), FPGA (FPGA1.16)
MODE_SEL: CLOCKANDSWITCH (R2.1 X1.8), FPGA (FPGA1.9)
PROG_SEL0: CLOCKANDSWITCH (R5.1 X1.6), FPGA (FPGA1.19)
PROG_SEL1: CLOCKANDSWITCH (R4.1 X1.5), FPGA (FPGA1.20)
SCL_AS111: FPGA (FPGA1.23), 7seg (R16.1 U3.14)
SDA_AS111: FPGA (FPGA1.25), 7seg (R17.1 U3.1)
SPEED_SEL: CLOCKANDSWITCH (R3.1 X1.7), FPGA (FPGA1.10)
STEP_BTN: CLOCKANDSWITCH (R1.1 SW1.3), FPGA (FPGA1.12)